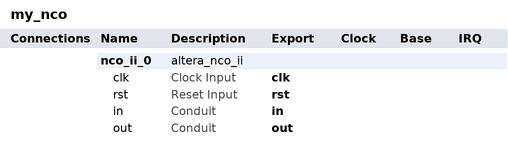
[diagram p0: system contents]
# Platform Designer (Qsys) system my_nco, Cyclone IV E EP4CE115F29I7
# Parameters at their usual value, and those the tool derives, are not listed.
package require -exact qsys 15.0
create_system my_nco
set_project_property DEVICE_FAMILY {Cyclone IV E}
set_project_property DEVICE EP4CE115F29I7

add_instance nco_ii_0 altera_nco_ii 15.0
set_instance_property nco_ii_0 AUTO_EXPORT true
set_instance_parameter_value nco_ii_0 apr 34
set_instance_parameter_value nco_ii_0 aprf 34
set_instance_parameter_value nco_ii_0 apri 10
set_instance_parameter_value nco_ii_0 arch large_rom
set_instance_parameter_value nco_ii_0 freq_out 6.0
set_instance_parameter_value nco_ii_0 fsamp 32.0
set_instance_parameter_value nco_ii_0 mpr 10
set_instance_parameter_value nco_ii_0 selected_device_family {Cyclone IV E}
set_instance_parameter_value nco_ii_0 want_freq_mod true
set_instance_parameter_value nco_ii_0 want_sin_and_cos dual_output

# exported interfaces
add_interface clk clock sink
set_interface_property clk EXPORT_OF nco_ii_0.clk
add_interface in conduit end
set_interface_property in EXPORT_OF nco_ii_0.in
add_interface out conduit end
set_interface_property out EXPORT_OF nco_ii_0.out
add_interface rst reset sink
set_interface_property rst EXPORT_OF nco_ii_0.rst

set_interconnect_requirement {$system} qsys_mm.clockCrossingAdapter HANDSHAKE
set_interconnect_requirement {$system} qsys_mm.enableEccProtection FALSE
set_interconnect_requirement {$system} qsys_mm.insertDefaultSlave FALSE
set_interconnect_requirement {$system} qsys_mm.maxAdditionalLatency 1

save_system my_nco.qsys
